# EAGLE design untitled (EAGLE 9.6.1)
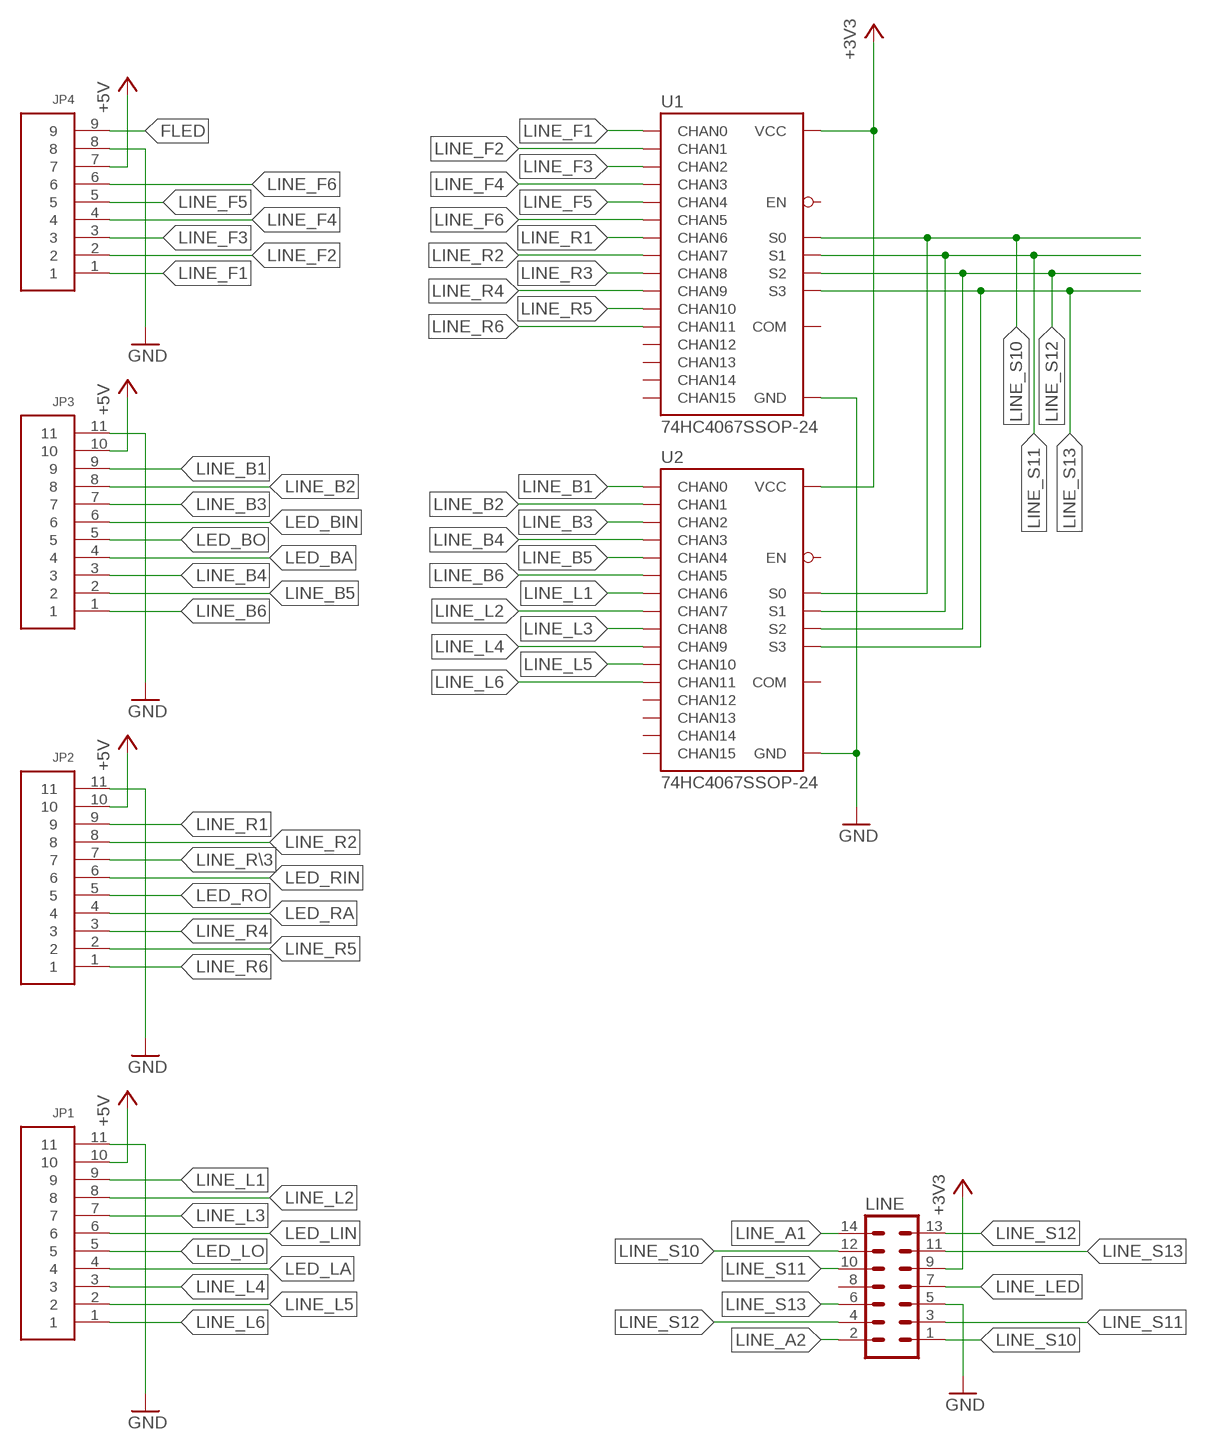
[diagram p0: schematic, sheet 1]

## Parts
JP1  11PIN  [B11B-PH-K-S]
JP2  11PIN  [B11B-PH-K-S]
JP3  11PIN  [B11B-PH-K-S]
JP4  9PIN  [B9B-PH-K-S]
LINE  MA07-2  [MA07-2]
U1  74HC4067SSOP-24  [SSOP24]
U2  74HC4067SSOP-24  [SSOP24]

## Nets
+3V3: LINE.9 U1.24(VCC) U2.24(VCC)
+5V: JP1.10 JP2.10 JP3.10 JP4.7
FLED: JP4.9
GND: JP1.11 JP2.11 JP3.11 JP4.8 LINE.5 U1.12(GND) U2.12(GND)
LED_BA: JP3.4
LED_BIN: JP3.6
LED_BO: JP3.5
LED_LA: JP1.4
LED_LIN: JP1.6
LED_LO: JP1.5
LED_RA: JP2.4
LED_RIN: JP2.6
LED_RO: JP2.5
LINE_A1: LINE.14
LINE_A2: LINE.2
LINE_B1: JP3.9 U2.9(CHAN0)
LINE_B2: JP3.8 U2.8(CHAN1)
LINE_B3: JP3.7 U2.7(CHAN2)
LINE_B4: JP3.3 U2.6(CHAN3)
LINE_B5: JP3.2 U2.5(CHAN4)
LINE_B6: JP3.1 U2.4(CHAN5)
LINE_F1: JP4.1 U1.9(CHAN0)
LINE_F2: JP4.2 U1.8(CHAN1)
LINE_F3: JP4.3 U1.7(CHAN2)
LINE_F4: JP4.4 U1.6(CHAN3)
LINE_F5: JP4.5 U1.5(CHAN4)
LINE_F6: JP4.6 U1.4(CHAN5)
LINE_L1: JP1.9 U2.3(CHAN6)
LINE_L2: JP1.8 U2.2(CHAN7)
LINE_L3: JP1.7 U2.23(CHAN8)
LINE_L4: JP1.3 U2.22(CHAN9)
LINE_L5: JP1.2 U2.21(CHAN10)
LINE_L6: JP1.1 U2.20(CHAN11)
LINE_LED: LINE.7
LINE_R1: JP2.9 U1.3(CHAN6)
LINE_R2: JP2.8 U1.2(CHAN7)
LINE_R3: U1.23(CHAN8)
LINE_R4: JP2.3 U1.22(CHAN9)
LINE_R5: JP2.2 U1.21(CHAN10)
LINE_R6: JP2.1 U1.20(CHAN11)
LINE_R\3: JP2.7
LINE_S10: LINE.1 LINE.12 U1.10(S0) U2.10(S0)
LINE_S11: LINE.3 LINE.10 U1.11(S1) U2.11(S1)
LINE_S12: LINE.4 LINE.13 U1.14(S2) U2.14(S2)
LINE_S13: LINE.6 LINE.11 U1.13(S3) U2.13(S3)
Unconnected: LINE.8 U1.1(COM) U1.15(EN) U1.16(CHAN15) U1.17(CHAN14) U1.18(CHAN13) U1.19(CHAN12) U2.1(COM) U2.15(EN) U2.16(CHAN15) U2.17(CHAN14) U2.18(CHAN13) U2.19(CHAN12)

## Library data of the parts
JP1-JP3 = jst_eph:11PIN
JP4 = jst_eph:9PIN
LINE = con-lstb:MA07-2: PIN HEADER; OC_FARNELL: unknown; OC_NEWARK: unknown
U1 U2 = 74HC4067:74HC4067: Check availability <https://pricing.snapeda.com/parts/74HC4067/Nexperia/view-part?ref=eda>; AVAILABILITY: In Stock; DESCRIPTION: Analog Switch/Analog Multiplexer Single 16:1 24-Pin SSOP T/R; MF: Nexperia; MP: 74HC4067; PACKAGE: None; PRICE: None; PURCHASE-URL: https://pricing.snapeda.com/search/part/74HC4067/?ref=eda

## Board
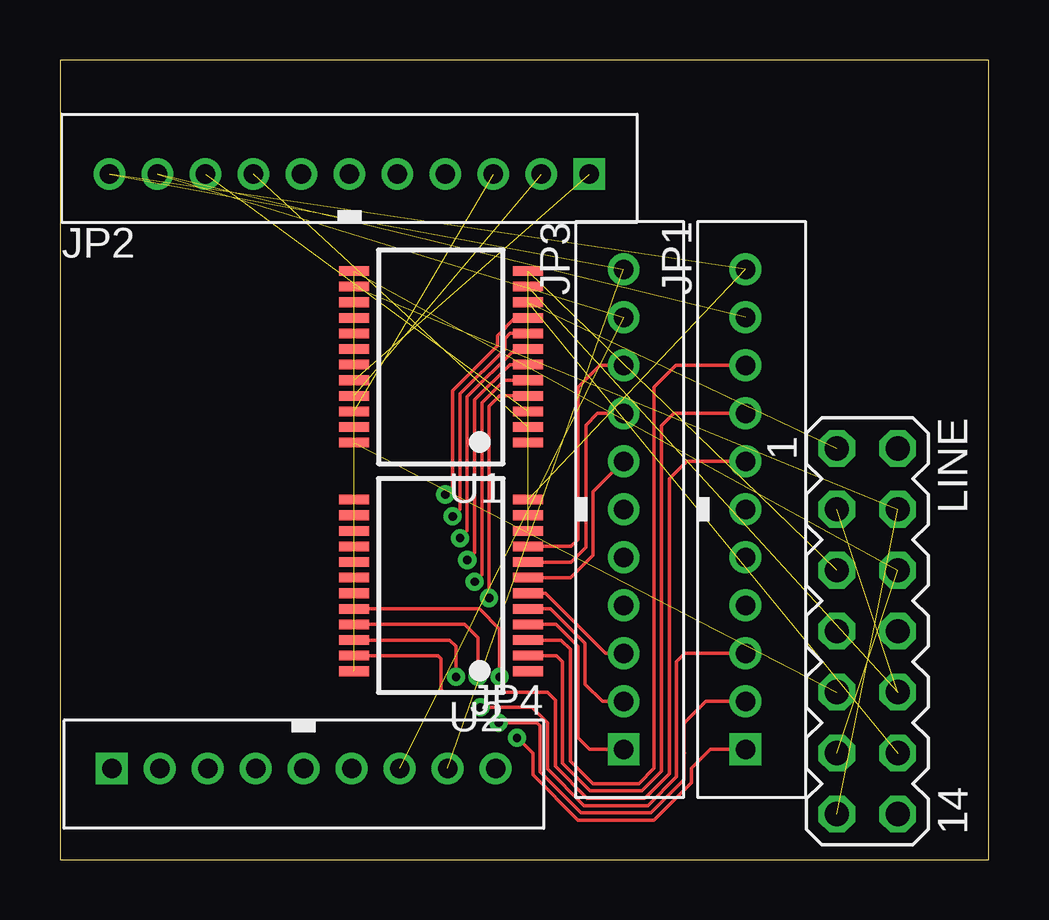
[diagram p1: board, top side]
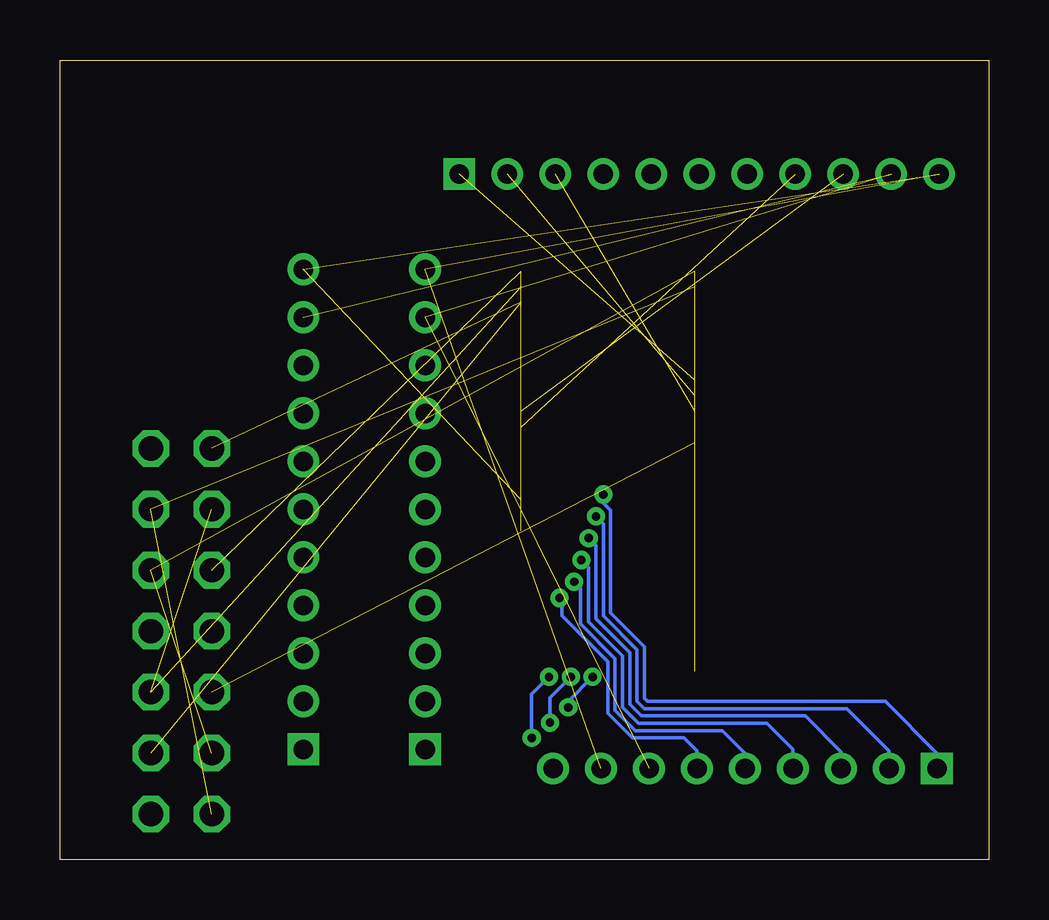
[diagram p2: board, bottom side, seen from below]

Size 38.72 x 33.33 mm. Coordinates in mm from the lower left corner, seen from the top.
Outline: 0,0 38.72,0 38.72,33.33 0,33.33 0,0
Copper layers (1*16): Top 0.035mm / dielectric 1.5mm / Bottom 0.035mm
Design rules "default": minimum track width 6mil, minimum drill 0.35mm, track to track 6mil, track to pad 6mil, pad to pad 6mil, via to via 6mil, smd to smd 6mil, copper to edge 40mil, drill to drill 6mil, minimum pad ring 10mil, minimum via ring 8mil, stop-mask expansion 4mil, vias tented up to drill 0mil, thermal gap 10mil

### Footprints (pad centres in the part's own frame; a part is rotated, then mirrored left to right if it is on the bottom)
B11B-PH-K-S = drill 0.813 square: 1 10,0 | drill 0.813: 2 8,0; 3 6,0; 4 4,0; 5 2,0; 6 0,0; 7 -2,0; 8 -4,0; 9 -6,0; 10 -8,0; 11 -10,0
B9B-PH-K-S = drill 0.813 square: 1 8,0 | drill 0.813: 2 6,0; 3 4,0; 4 2,0; 5 0,0; 6 -2,0; 7 -4,0; 8 -6,0; 9 -8,0
MA07-2 = drill 1.016 octagon: 1 -7.62,-1.27; 2 -7.62,1.27; 3 -5.08,-1.27; 4 -5.08,1.27; 5 -2.54,-1.27; 6 -2.54,1.27; 7 0,-1.27; 8 0,1.27; 9 2.54,-1.27; 10 2.54,1.27; 11 5.08,-1.27; 12 5.08,1.27; 13 7.62,-1.27; 14 7.62,1.27
SSOP24 = smd 0.4 x 1.25: 1 -3.575,-3.625; 2 -2.925,-3.625; 3 -2.275,-3.625; 4 -1.625,-3.625; 5 -0.975,-3.625; 6 -0.325,-3.625; 7 0.325,-3.625; 8 0.975,-3.625; 9 1.625,-3.625; 10 2.275,-3.625; 11 2.925,-3.625; 12 3.575,-3.625; 13 3.575,3.625; 14 2.925,3.625; 15 2.275,3.625; 16 1.625,3.625; 17 0.975,3.625; 18 0.325,3.625; 19 -0.325,3.625; 20 -0.975,3.625; 21 -1.625,3.625; 22 -2.275,3.625; 23 -2.925,3.625; 24 -3.575,3.625

### Placement (x,y rotation side)
JP1  28.57,14.61 270 top
JP2  12.06,28.57 0 top
JP3  23.5,14.61 270 top
JP4  10.16,3.81 180 top
LINE  33.66,9.53 270 top
U1  15.88,20.95 90 top
U2  15.88,11.43 90 top

### Tracks (layer width: path | path; a pad name or v marks a point on that pad's centre or on a via)
+3V3  (2 unrouted)
+5V  (3 unrouted)
GND  (6 unrouted)
LINE_B1
  Top 0.152: U2.9 21.31,13.05 21.59,13.34 21.59,19.68 22.51,20.61 JP3.9
LINE_B2
  Top 0.152: U2.8 21.3,12.4 21.92,13.03 21.92,18.11 22.41,18.61 JP3.8
LINE_B3
  Top 0.152: JP3.7 22.23,15.34 22.23,12.7 21.28,11.76 U2.7
LINE_B4
  Top 0.152: U2.6 20.24,11.11 22.74,8.61 JP3.3
LINE_B5
  Top 0.152: JP3.2 22.61,6.61 21.89,7.32 21.89,9.02 20.46,10.46 U2.5
LINE_B6
  Top 0.152: U2.4 20.68,9.8 21.59,8.89 21.59,5.08 22.07,4.61 JP3.1
LINE_F1  (via drill 0.35)
  Top 0.152: v16.07,15.22 16.37,15.52 16.37,19.54 18.24,21.41 18.24,21.84 18.97,22.58 U1.9
  Bottom 0.152: JP4.1 2.16,4.45 4.32,6.6 14.23,6.6 14.35,6.73 14.35,8.89 15.76,10.3 15.76,14.56 16.07,14.87 v16.07,15.22
LINE_F2  (via drill 0.35)
  Top 0.152: v16.37,14.31 16.67,14.61 16.67,19.41 18.54,21.28 18.54,21.72 18.75,21.93 U1.8
  Bottom 0.152: JP4.2 4.16,4.54 5.92,6.3 14.35,6.3 14.66,6.6 14.66,8.76 16.07,10.17 16.07,14.01 v16.37,14.31
LINE_F3  (via drill 0.35)
  Top 0.152: v16.68,13.4 16.98,13.71 16.98,19.29 18.97,21.28 U1.7
  Bottom 0.152: JP4.3 6.16,4.51 7.64,5.99 14.48,5.99 14.96,6.48 14.96,8.63 16.37,10.05 16.37,13.1 v16.68,13.4
LINE_F4  (via drill 0.35)
  Top 0.152: v16.98,12.49 17.28,12.8 17.28,19.16 18.75,20.63 U1.6
  Bottom 0.152: JP4.4 8.16,4.6 9.25,5.69 14.61,5.69 15.27,6.35 15.27,8.51 16.68,9.92 16.68,12.19 v16.98,12.49
LINE_F5  (via drill 0.35)
  Top 0.152: v17.29,11.59 17.59,11.89 17.59,19.03 18.53,19.98 U1.5
  Bottom 0.152: JP4.5 10.16,4.45 11.1,5.38 14.73,5.38 15.57,6.22 15.57,8.38 17.02,9.83 17.02,11.32 v17.29,11.59
LINE_F6  (via drill 0.35)
  Top 0.152: v17.89,10.91 17.89,18.91 18.31,19.33 U1.4
  Bottom 0.152: JP4.6 12.16,4.54 12.7,5.08 14.86,5.08 15.88,6.1 15.88,8.26 17.78,10.16 17.78,10.79 v17.89,10.91
LINE_L1
  Top 0.152: U2.3 20.89,9.15 21.29,8.76 21.29,4.12 22.23,3.17 24.13,3.17 24.77,3.81 24.77,19.68 25.68,20.61 JP1.9
LINE_L2
  Top 0.152: U2.2 20.7,8.51 20.95,8.26 20.95,4.01 22.1,2.87 24.26,2.87 25.07,3.68 25.07,18.09 25.59,18.61 JP1.8
LINE_L3
  Top 0.152: JP1.7 26.13,16.61 25.4,15.88 25.4,3.58 24.38,2.56 21.97,2.56 20.65,3.89 20.65,6.66 20.32,6.99 16,6.99 15.88,7.11 15.88,8.38 15.75,8.51 U2.23
LINE_L4  (via drill 0.35)
  Top 0.152: JP1.3 26.05,8.61 25.7,8.26 25.7,3.46 24.51,2.26 21.85,2.26 20.32,3.79 20.32,5.71 19.68,6.35 v17.53,6.35 | U2.22 16.25,9.15 16.51,8.89 v16.51,7.62
  Bottom 0.152: v16.51,7.62 17.53,6.6 v17.53,6.35
LINE_L5  (via drill 0.35)
  Top 0.152: U2.21 16.86,9.8 17.42,9.25 v17.42,7.62 | v18.29,5.71 19.89,5.71 20.02,5.59 20.02,3.66 21.72,1.96 24.64,1.96 26.01,3.33 26.01,4.42 | 26.01,4.42 26.04,4.45 | 26.01,4.42 26.01,5.69 26.93,6.61 JP1.2
  Bottom 0.152: v17.42,7.62 18.29,6.75 v18.29,5.71
LINE_L6  (via drill 0.35)
  Top 0.152: JP1.1 27.11,4.61 26.31,3.81 26.31,3.2 24.76,1.65 21.59,1.65 19.71,3.53 19.71,4.45 19.07,5.08 v19.05,5.08 | U2.20 17.48,10.46 18.33,9.61 v18.33,7.62
  Bottom 0.152: v18.33,7.62 19.05,6.9 v19.05,5.08
LINE_R1  (1 unrouted)
LINE_R2  (1 unrouted)
LINE_R4  (1 unrouted)
LINE_R5  (1 unrouted)
LINE_R6  (1 unrouted)
LINE_S10  (3 unrouted)
LINE_S11  (3 unrouted)
LINE_S12  (3 unrouted)
LINE_S13  (3 unrouted)